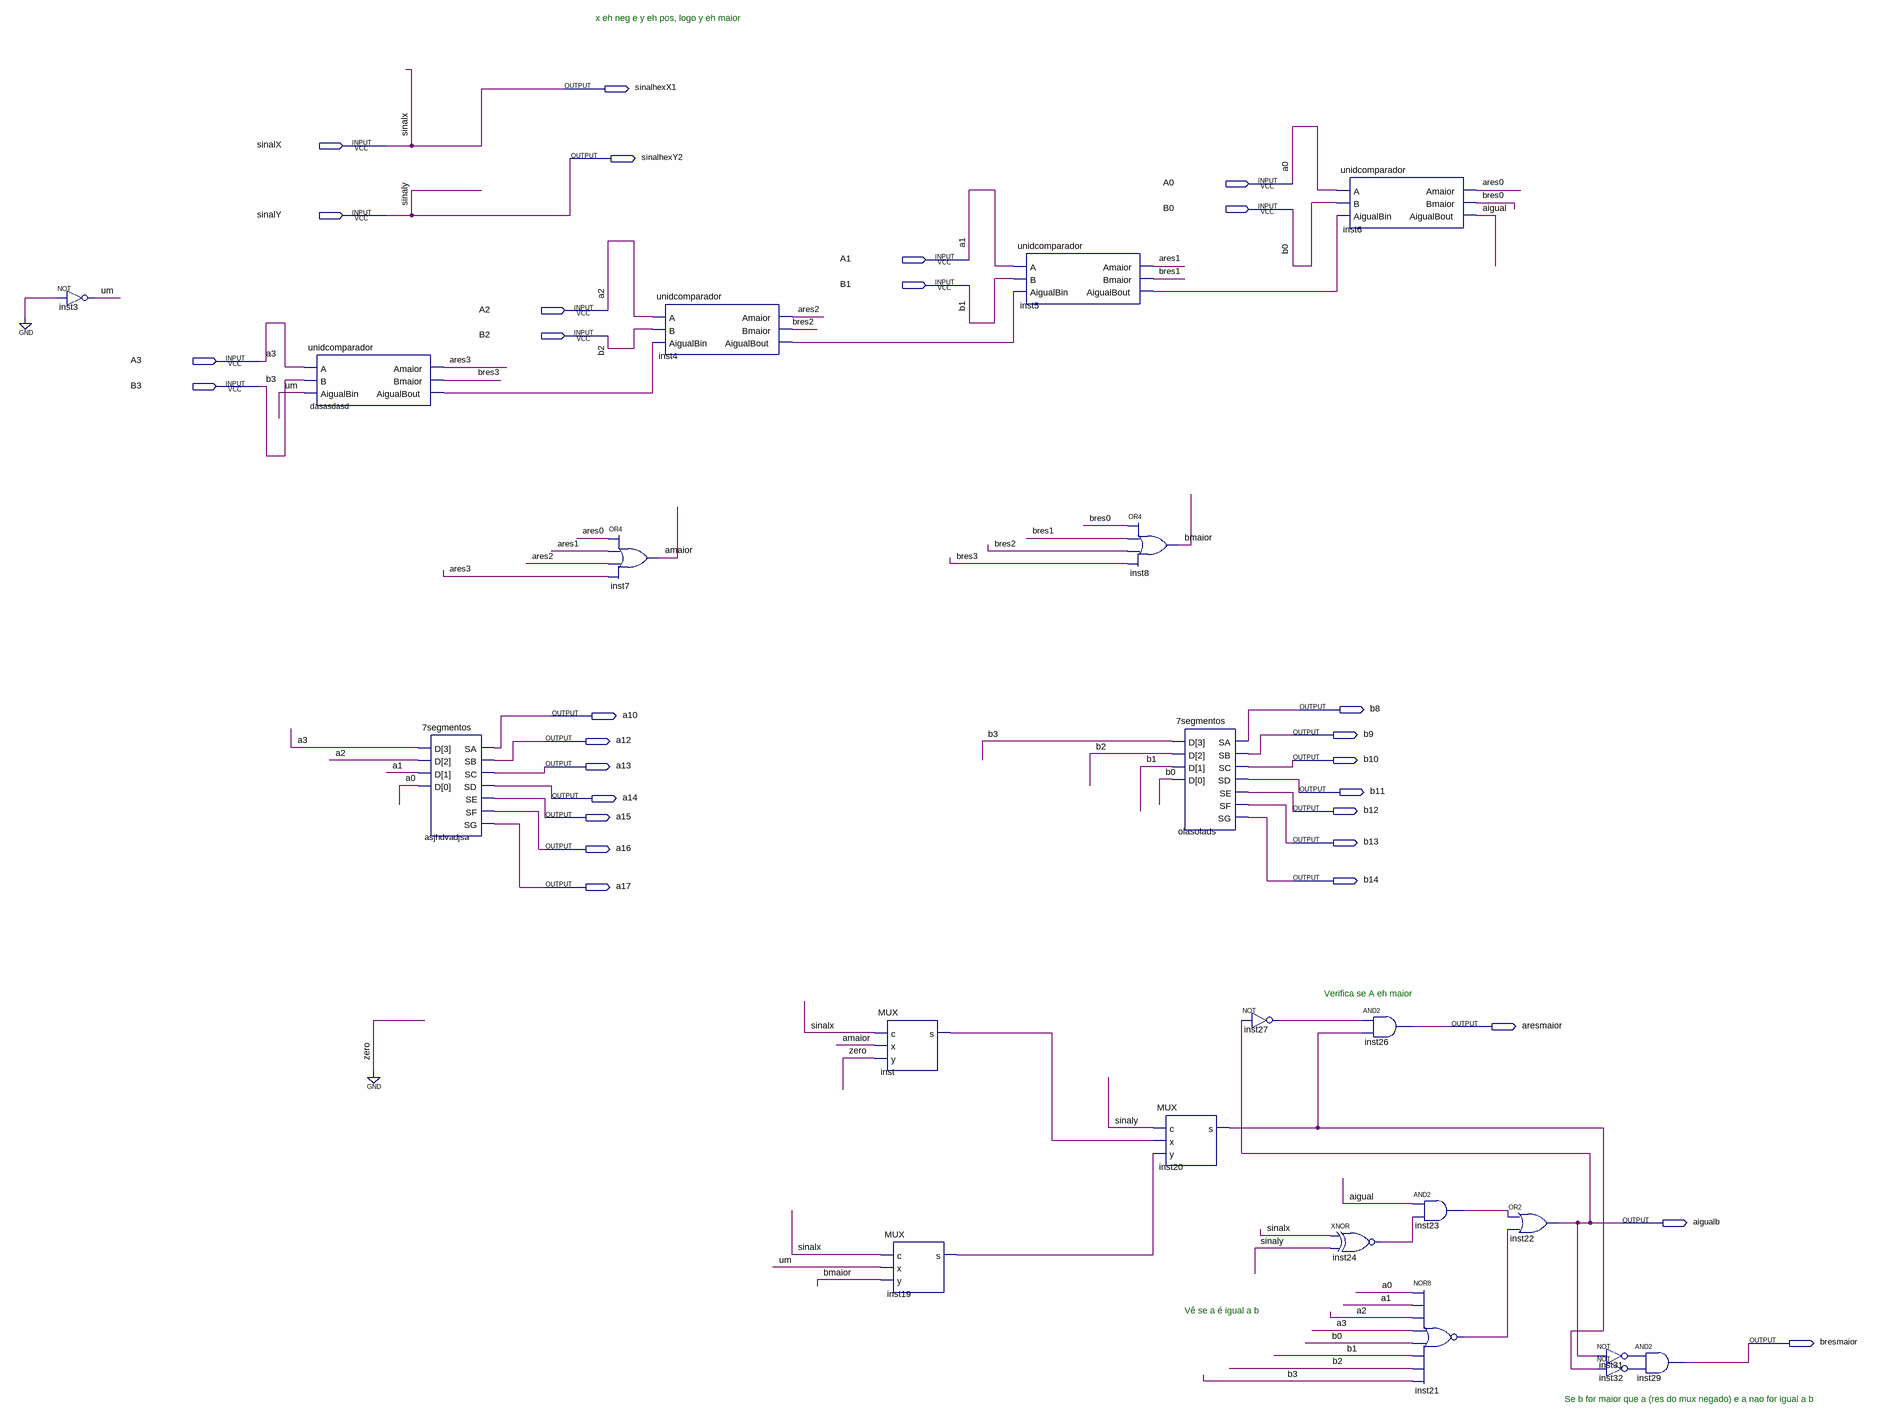
[diagram p0: schematic sheet]
// Quartus schematic comparador.bdf as structural Verilog: 21 symbols, 29 pins
module comparador (
  input  sinalX,
  input  A0,
  input  B0,
  input  sinalY,
  input  A1,
  input  B1,
  input  A2,
  input  B2,
  input  A3,
  input  B3,
  output sinalhexX1,
  output sinalhexY2,
  output b8,
  output a10,
  output b9,
  output a12,
  output b10,
  output a13,
  output b11,
  output a14,
  output b12,
  output a15,
  output b13,
  output a16,
  output b14,
  output a17,
  output aresmaior,
  output aigualb,
  output bresmaior
);

  wire aigual, amaior, ares0, ares1, ares2, ares3, bmaior, bres0, bres1, bres2, bres3, dasasdasd_aigualbout,
       inst4_aigualbout, inst5_aigualbout, inst19_s, inst20_s, inst21_out, inst23_out, inst24_out,
       inst27_out, inst31_out, inst32_out, inst_s, um;

  not inst3 (um, 1'b0);
  unidcomparador dasasdasd (
    .A(A3), .B(B3), .AigualBin(um), .Amaior(ares3), .Bmaior(bres3), .AigualBout(dasasdasd_aigualbout));
  \7segmentos  asjhdvadjsa (.D({A3, A2, A1, A0}), .SA(a10), .SB(a12), .SC(a13), .SD(a14), .SE(a15), .SF(a16), .SG(a17));
  or inst7 (amaior, ares0, ares1, ares2, ares3);
  unidcomparador inst4 (
    .A(A2), .B(B2), .AigualBin(dasasdasd_aigualbout), .Amaior(ares2), .Bmaior(bres2),
    .AigualBout(inst4_aigualbout));
  MUX inst (.c(sinalX), .x(amaior), .y(1'b0), .s(inst_s));
  MUX inst19 (.c(sinalX), .x(um), .y(bmaior), .s(inst19_s));
  unidcomparador inst5 (
    .A(A1), .B(B1), .AigualBin(inst4_aigualbout), .Amaior(ares1), .Bmaior(bres1),
    .AigualBout(inst5_aigualbout));
  or inst8 (bmaior, bres0, bres1, bres2, bres3);
  \7segmentos  olasolads (.D({B3, B2, B1, B0}), .SA(b8), .SB(b9), .SC(b10), .SD(b11), .SE(b12), .SF(b13), .SG(b14));
  MUX inst20 (.c(sinalY), .x(inst_s), .y(inst19_s), .s(inst20_s));
  not inst27 (inst27_out, aigualb);
  unidcomparador inst6 (
    .A(A0), .B(B0), .AigualBin(inst5_aigualbout), .Amaior(ares0), .Bmaior(bres0), .AigualBout(aigual));
  xnor inst24 (inst24_out, sinalX, sinalY);
  and inst26 (aresmaior, inst27_out, inst20_s);
  and inst23 (inst23_out, aigual, inst24_out);
  nor inst21 (inst21_out, A0, A1, A2, A3, B0, B1, B2, B3);
  or inst22 (aigualb, inst23_out, inst21_out);
  and inst29 (bresmaior, inst31_out, inst32_out);
  not inst31 (inst31_out, aigualb);
  not inst32 (inst32_out, inst20_s);

  assign sinalhexX1 = sinalX;
  assign sinalhexY2 = sinalY;

  // Notes on the sheet:
  //   x eh neg e y eh pos, logo y eh maior
  //   Verifica se A eh maior
  //   Vê se a é igual a b
  //   Se b for maior que a (res do mux negado) e a nao for igual a b
endmodule
